# EAGLE design untitled (EAGLE 6.6.0)
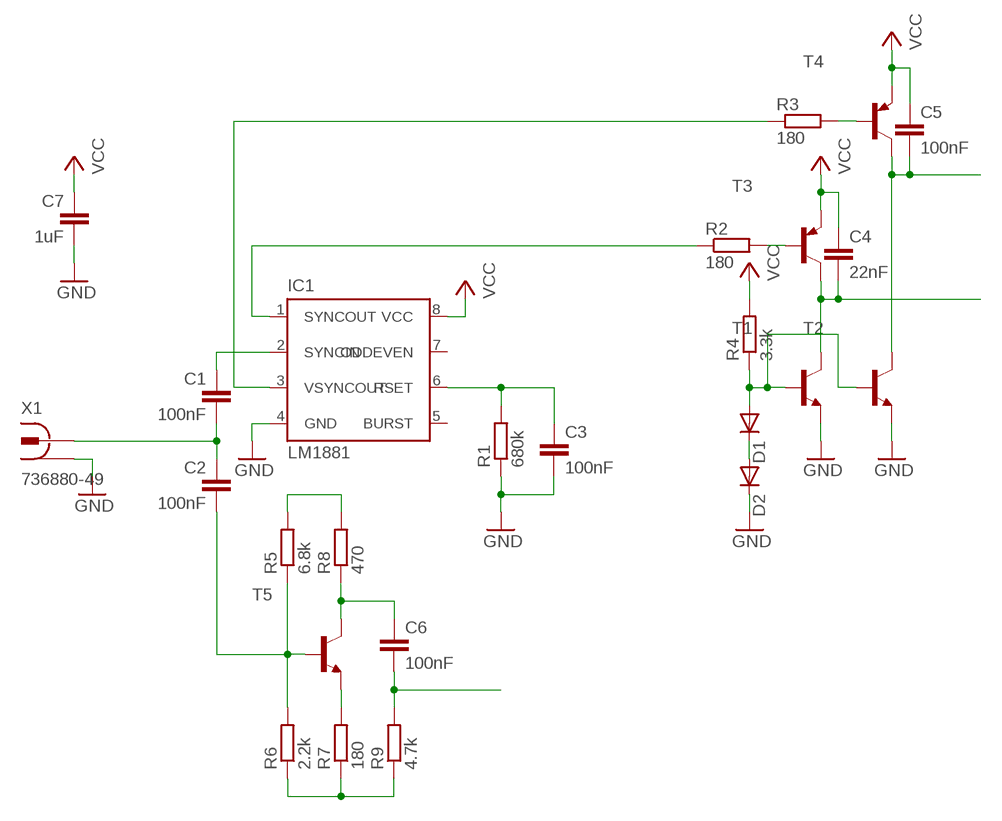
[diagram p0: schematic, sheet 1]

## Parts
C1  100nF  C-EUC0805  [C0805]
C2  100nF  C-EUC0805  [C0805]
C3  100nF  C-EUC0805  [C0805]
C4  22nF  C-EUC0805  [C0805]
C5  100nF  C-EUC0805  [C0805]
C6  100nF  C-EUC0805  [C0805]
C7  1uF  C-EUC0805  [C0805]
D1  DIODE-MELF-MLL41  [MELF-MLL41]
D2  DIODE-MELF-MLL41  [MELF-MLL41]
IC1  LM1881  [DIL08]
R1  680k  R-EU_R0805  [R0805]
R2  180  R-EU_R0805  [R0805]
R3  180  R-EU_R0805  [R0805]
R4  3.3k  R-EU_R0805  [R0805]
R5  6.8k  R-EU_R0805  [R0805]
R6  2.2k  R-EU_R0805  [R0805]
R7  180  R-EU_R0805  [R0805]
R8  470  R-EU_R0805  [R0805]
R9  4.7k  R-EU_R0805  [R0805]
T1  -NPN-SOT23-EBC  [SOT23-EBC]
T2  -NPN-SOT23-EBC  [SOT23-EBC]
T3  -PNP-SOT23-BCE  [SOT23-BCE]
T4  -PNP-SOT23-BCE  [SOT23-BCE]
T5  -NPN-SOT23-EBC  [SOT23-EBC]
X1  736880-49  [736880-49]

## Nets
GND: C3.2 C7.2 D2.C IC1.4(GND) R1.1 T1.E T2.E X1.1 X1.1@1 X1.1@2
N$1: IC1.3(VSYNCOUT) R3.1
N$2: C1.1 IC1.2(SYNCIN)
N$3: IC1.1(SYNCOUT) R2.1
N$4: C3.1 IC1.6(RSET) R1.2
N$5: R3.2 T4.B
N$6: C1.2 C2.1 X1.2
N$7: R2.2 T3.B
N$8: C2.2 R5.1 R6.2 T5.B
N$9: C5.2 T2.C T4.C
N$10: C4.2 T1.C T3.C
N$11: D1.C D2.A
N$12: D1.A R4.1 T1.B T2.B
N$13: R5.2 R8.2
N$14: R6.1 R7.1 R9.1
N$16: R7.2 T5.E
N$17: C6.1 R8.1 T5.C
N$18: C6.2 R9.2
VCC: C4.1 C5.1 C7.1 IC1.8(VCC) R4.2 T3.E T4.E
Unconnected: IC1.5(BURST) IC1.7(ODDEVEN)

## Library data of the parts
C1-C7 = rcl:C-EU: CAPACITOR, European symbol
D1 D2 = diode:DIODE-: DIODE
IC1 = lm1881:LM1881
R1-R9 = rcl:R-EU_: RESISTOR, European symbol
T1 T2 T5 = transistor:*-NPN-: NPN Transistror BF959 corrected 2008.03.06
T3 T4 = transistor:*-PNP-: PNP Transistror
X1 = con-conrad:736880-49: Cinch Connector ( RCA Jack ) Cinch-Einbaukupplung 90º 72345 Vernickelt BKL Electronic Source: Conrad <http://www.conrad.de/ce/de/product/736880>

## Board
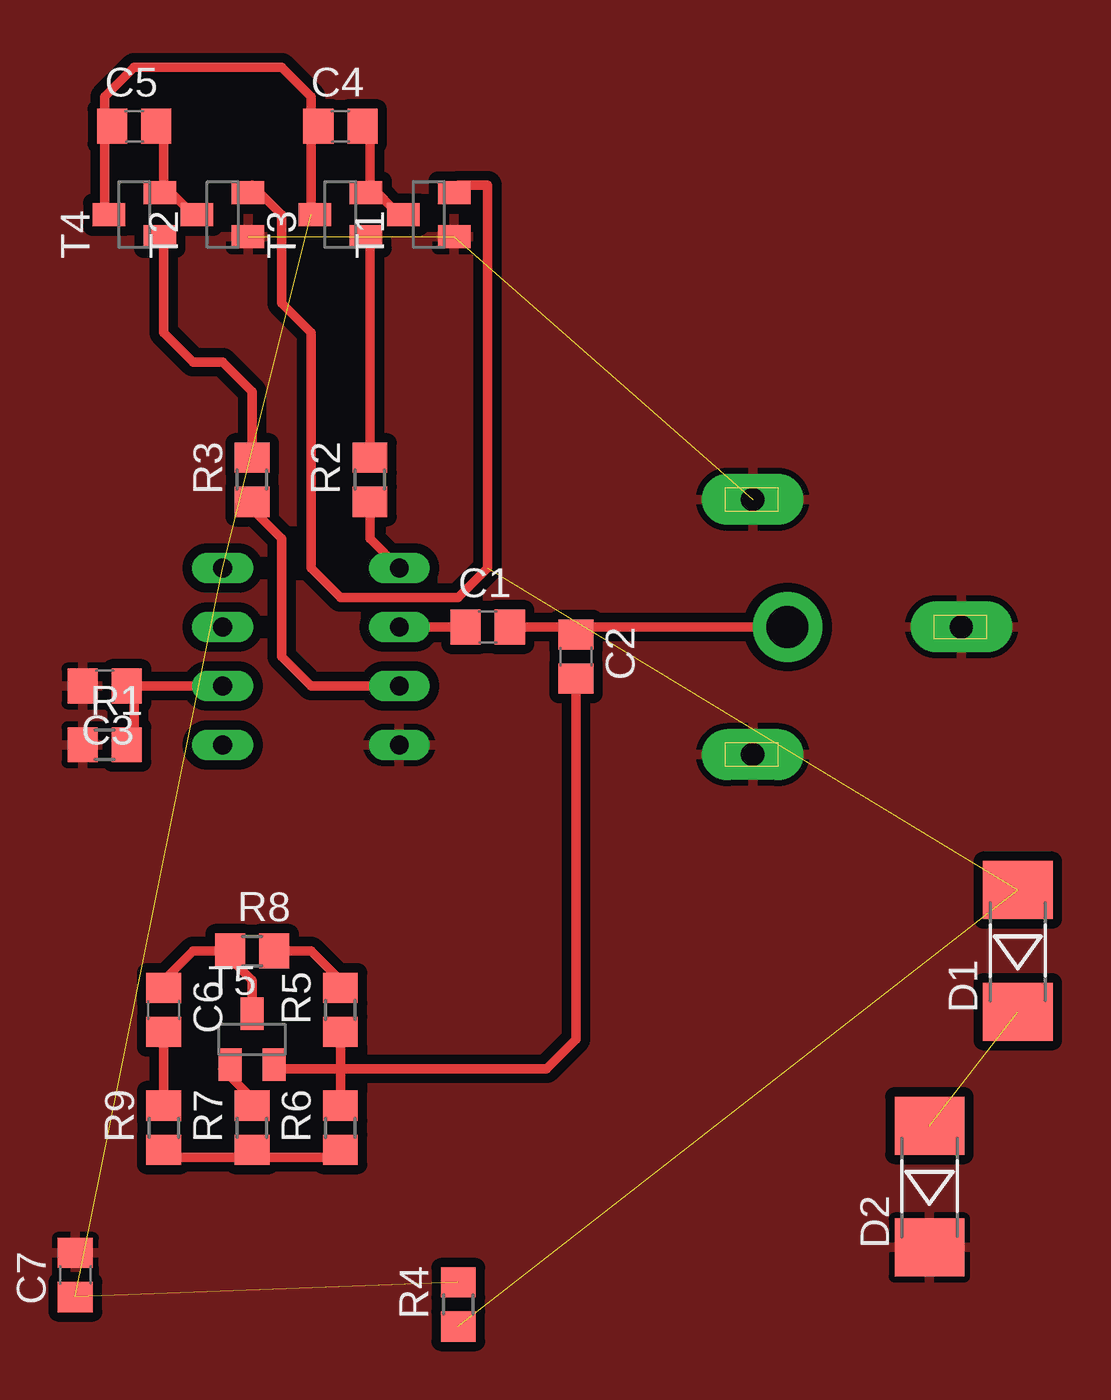
[diagram p1: board, top side]
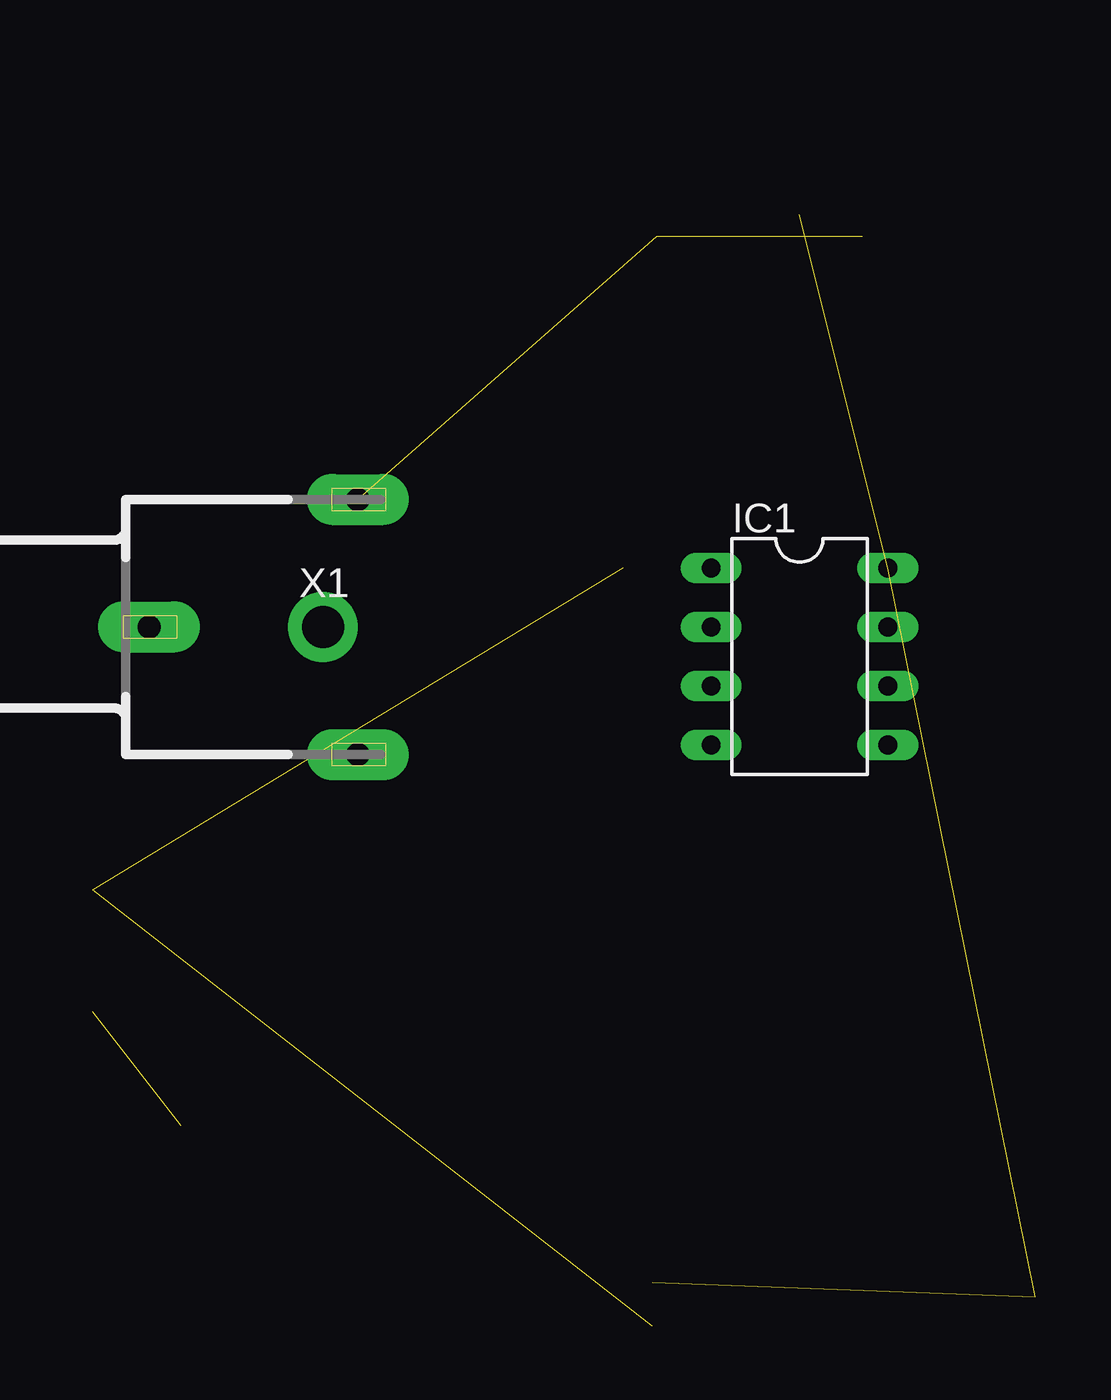
[diagram p2: board, bottom side, seen from below]

No outline drawn. Coordinates in mm, seen from the top.
Copper layers (1*16): Top 0.035mm / dielectric 1.5mm / Bottom 0.035mm
Design rules "default": minimum track width 10mil, minimum drill 24mil, track to track 8mil, track to pad 8mil, pad to pad 8mil, via to via 8mil, smd to smd 8mil, copper to edge 40mil, drill to drill 8mil, minimum pad ring 10mil, minimum via ring 8mil, stop-mask expansion 4mil, vias tented up to drill 0mil, thermal gap 10mil

### Footprints (pad centres in the part's own frame; a part is rotated, then mirrored left to right if it is on the bottom)
C0805 = smd 1.3 x 1.5: 1 -0.95,0; 2 0.95,0
MELF-MLL41 = smd 2.5 x 3: A 2.625,0; C -2.625,0
DIL08 = drill 0.813 long: 1 -3.81,-3.81; 2 -1.27,-3.81; 3 1.27,-3.81; 4 3.81,-3.81; 5 3.81,3.81; 6 1.27,3.81; 7 -1.27,3.81; 8 -3.81,3.81
R0805 = smd 1.3 x 1.5: 1 -0.95,0; 2 0.95,0
SOT23-EBC = smd 1 x 1.4: B 0.95,-1.1; C 0,1.1; E -0.95,-1.1
SOT23-BCE = smd 1 x 1.4: B -0.95,-1.1; C 0.95,-1.1; E 0,1.1
736880-49 = drill 1 pad 2.2 long: 1 -3.92,0; 1@1 5.08,-5.5; 1@2 5.08,5.5 | drill 1.8 pad 3: 2 3.58,0

### Placement (x,y rotation side)
C1  48.26,33.02 0 top
C2  52.07,31.75 270 top
C3  31.75,30.48 180 top
C4  41.91,54.61 0 top
C5  33.02,54.61 0 top
C6  34.29,16.51 270 top
C7  30.48,5.08 90 top
D1  71.12,19.05 90 top
D2  67.31,8.89 90 top
IC1  40.64,31.75 270 bottom
R1  31.75,27.94 0 top
R2  43.18,39.37 90 top
R3  38.1,39.37 90 top
R4  46.99,3.81 90 top
R5  41.91,16.51 90 top
R6  41.91,11.43 90 top
R7  38.1,11.43 90 top
R8  38.1,19.05 0 top
R9  34.29,11.43 90 top
T1  45.72,50.8 90 top
T2  36.83,50.8 90 top
T3  41.91,50.8 90 top
T4  33.02,50.8 90 top
T5  38.1,15.24 0 top
X1  64.77,33.02 0 bottom

### Tracks (layer width: path | path; a pad name or v marks a point on that pad's centre or on a via)
GND  (2 unrouted)
  pour Top (isolate 0.406): -17.78,2.54 -17.78,66.04 82.55,66.04 82.55,-2.54 -17.78,-2.54
N$1
  Top 0.406: IC1.3 40.64,30.48 39.37,31.75 39.37,36.83 38.1,38.1 R3.1
N$2
  Top 0.406: IC1.2 C1.1
N$3
  Top 0.406: IC1.1 43.18,36.83 R2.1
N$4
  Top 0.406: IC1.6 33.02,30.48 | C3.1 33.02,30.48 | 33.02,30.48 33.02,27.94 R1.2
N$5
  Top 0.406: R3.2 38.1,43.18 36.83,44.45 35.56,44.45 34.29,45.72 34.29,49.53 34.12,49.7 T4.B
N$6
  Top 0.406: X1.2 52.07,33.02 | C2.1 52.07,33.02 | 52.07,33.02 C1.2
N$7
  Top 0.406: T3.B 43.01,49.7 43.18,49.53 R2.2
N$8
  Top 0.406: T5.B 39.2,14.14 39.37,13.97 41.91,13.97 | R6.2 41.91,13.97 | R5.1 41.91,13.97 | 41.91,13.97 50.8,13.97 52.07,15.24 C2.2
N$9
  Top 0.406: T4.C 34.12,51.9 34.29,52.07 | C5.2 34.29,54.61 34.29,52.07 | T2.C 35.56,50.8 34.29,52.07
N$10
  Top 0.406: T3.C 43.01,51.9 43.18,52.07 | 43.18,52.07 43.18,54.61 C4.2 | T1.C 44.45,50.8 43.18,52.07
N$11  (1 unrouted)
N$12  (2 unrouted)
  Top 0.406: T2.B 37.93,51.9 38.1,52.07 39.37,50.8 39.37,46.99 40.64,45.72 40.64,35.56 41.91,34.29 46.99,34.29 48.26,35.56 48.26,52.07 46.99,52.07 46.82,51.9 T1.B
N$13
  Top 0.406: R5.2 41.91,17.78 40.64,19.05 R8.2
N$14
  Top 0.406: R6.1 41.91,10.16 38.1,10.16 | R7.1 38.1,10.16 | R9.1 34.29,10.16 38.1,10.16
N$16
  Top 0.406: T5.E 37,14.14 36.83,13.97 38.1,12.7 R7.2
N$17
  Top 0.406: R8.1 36.83,19.05 | 36.83,19.05 38.1,17.78 T5.C | 36.83,19.05 35.56,19.05 34.29,17.78 C6.1
N$18
  Top 0.406: C6.2 R9.2
VCC  (3 unrouted)
  Top 0.406: 40.64,54.61 40.64,50.8 T3.E | T4.E 31.75,50.8 31.75,54.61 | C4.1 40.64,54.61 | 40.64,54.61 40.64,55.88 39.37,57.15 33.02,57.15 31.75,55.88 31.75,54.61 | 31.75,54.61 C5.1